# EAGLE design v3 bpard (EAGLE 6.4)
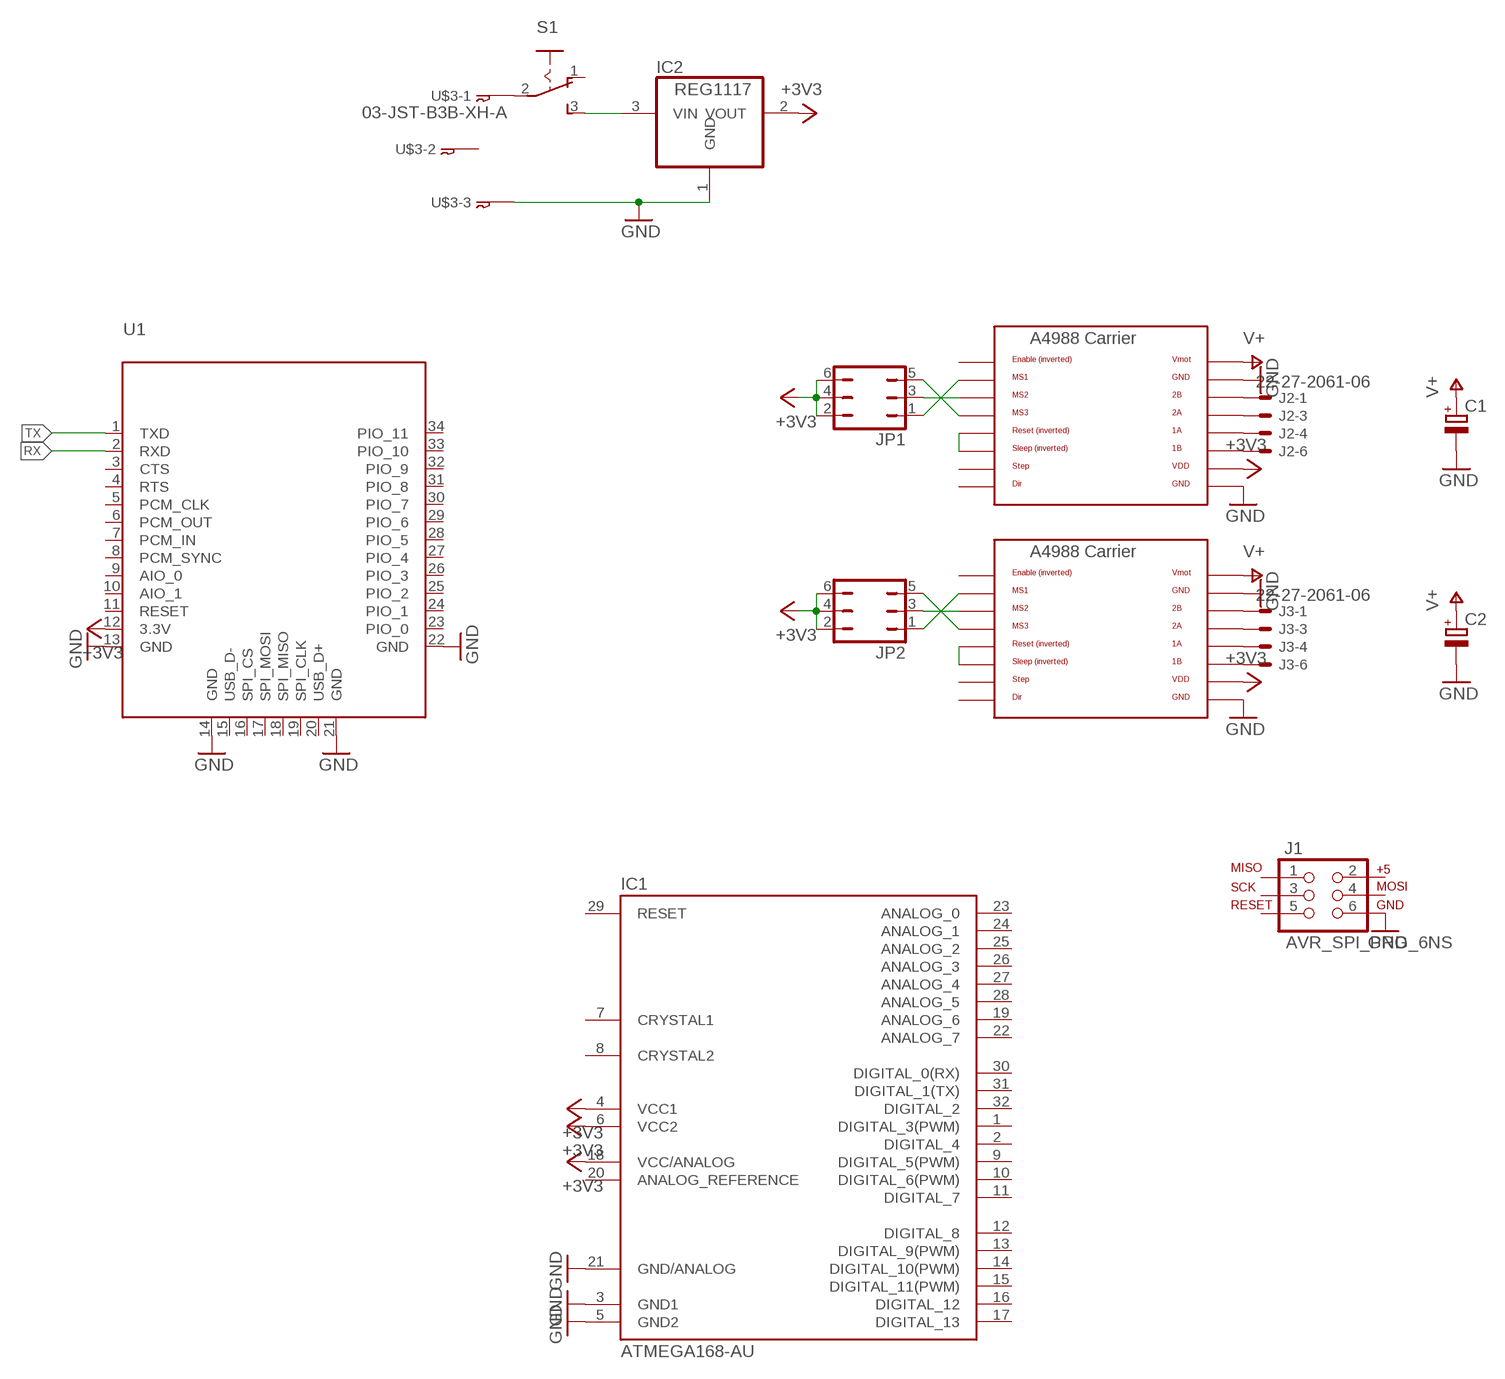
[diagram p0: schematic, sheet 1]

## Parts
C1  CPOL-EUE5-8.5  [E5-8,5]
C2  CPOL-EUE5-8.5  [E5-8,5]
IC1  ATMEGA168-AU  [TQFP32-08]
IC2  REG1117  [SOT223]
J1  AVR_SPI_PRG_6NS  [2X3-NS]
J2  22-27-2061-06  [6410-06]
J3  22-27-2061-06  [6410-06]
JP1  JP3Q  [JP3Q]
JP2  JP3Q  [JP3Q]
S1  255SB  [255SB]
U1  BLUETOOTH_MODULE  [BLUETOOTH_MODULE]
U$1  POLOLU_A4983CARRIER  [A4988BREAKOUT]
U$2  POLOLU_A4983CARRIER  [A4988BREAKOUT]
U$3  03-JST-B3B-XH-A  [B3B-XH]

## Nets
+3V3: IC1.4(VCC1) IC1.6(VCC2) IC1.18(VCC/ANALOG) IC2.2(VOUT) JP1.2 JP1.4 JP1.6 JP2.2 JP2.4 JP2.6 U1.12(3.3V) U$1.VDD U$2.VDD
GND: C1.- C2.- IC1.3(GND1) IC1.5(GND2) IC1.21(GND/ANALOG) IC2.1(GND) J1.6 U1.13(GND) U1.14(GND) U1.21(GND) U1.22(GND) U$1.GND U$1.GND@0(GND) U$2.GND U$2.GND@0(GND) U$3.P$3
N$1: J3.1 U$2.2B
N$2: J3.3 U$2.2A
N$3: J3.4 U$2.1A
N$4: J3.6 U$2.1B
N$5: J2.1 U$1.2B
N$6: J2.3 U$1.2A
N$7: J2.4 U$1.1A
N$8: J2.6 U$1.1B
N$9: JP2.5 U$2.MS3
N$10: JP1.3 U$1.MS2
N$11: JP2.1 U$2.MS1
N$12: JP1.1 U$1.MS1
N$13: JP2.3 U$2.MS2
N$14: JP1.5 U$1.MS3
N$15: S1.2(P) U$3.P$1
N$17: U$1.RST U$1.SLP(SLEEP)
N$18: U$2.RST U$2.SLP(SLEEP)
RX: U1.2(RXD)
TX: U1.1(TXD)
V+: C1.+ C2.+ IC2.3(VIN) S1.3(S) U$1.VMOT U$2.VMOT
Unconnected: IC1.1(DIGITAL_3(PWM)) IC1.2(DIGITAL_4) IC1.7(CRYSTAL1) IC1.8(CRYSTAL2) IC1.9(DIGITAL_5(PWM)) IC1.10(DIGITAL_6(PWM)) IC1.11(DIGITAL_7) IC1.12(DIGITAL_8) IC1.13(DIGITAL_9(PWM)) IC1.14(DIGITAL_10(PWM)) IC1.15(DIGITAL_11(PWM)) IC1.16(DIGITAL_12) IC1.17(DIGITAL_13) IC1.19(ANALOG_6) IC1.20(ANALOG_REFERENCE) IC1.22(ANALOG_7) IC1.23(ANALOG_0) IC1.24(ANALOG_1) IC1.25(ANALOG_2) IC1.26(ANALOG_3) IC1.27(ANALOG_4) IC1.28(ANALOG_5) IC1.29(RESET) IC1.30(DIGITAL_0(RX)) IC1.31(DIGITAL_1(TX)) IC1.32(DIGITAL_2) J1.1 J1.2 J1.3 J1.4 J1.5 J2.2 J2.5 J3.2 J3.5 S1.1(O) U1.3(CTS) U1.4(RTS) U1.5(PCM_CLK) U1.6(PCM_OUT) U1.7(PCM_IN) U1.8(PCM_SYNC) U1.9(AIO_0) U1.10(AIO_1) U1.11(RESET) U1.15(USB_D-) U1.16(SPI_CS) U1.17(SPI_MOSI) U1.18(SPI_MISO) U1.19(SPI_CLK) U1.20(USB_D+) U1.23(PIO_0) U1.24(PIO_1) U1.25(PIO_2) U1.26(PIO_3) U1.27(PIO_4) U1.28(PIO_5) U1.29(PIO_6) U1.30(PIO_7) U1.31(PIO_8) U1.32(PIO_9) U1.33(PIO_10) U1.34(PIO_11) U$1.DIR U$1.EN U$1.STEP U$2.DIR U$2.EN U$2.STEP U$3.P$2

## Library data of the parts
C1 C2 = rcl:CPOL-EU: POLARIZED CAPACITOR, European symbol
IC1 = Arduino-AVR:ATMEGA168
IC2 = burr-brown:REG1117: 800mA and 1A Low Dropout (LDO) Positive Regulator 1.8V, 2.5V, 2.85V, 3.3V, 5V, and Adj; MPN: REG1117; OC_FARNELL: 1097566; OC_NEWARK: 14P6981
J1 = AVR Header:AVR_SPI_PRG_6: AVR ISP 6 Pin This is the reduced ISP connector for AVR programming. Common on Arduino. This footprint will take up less PCB space and can be used with a 10-pin to 6-pin adapter such as SKU: BOB-08508
J2 J3 = con-molex:22-?-06: CONNECTOR wire to board 2.54 mm (.1 inch) pitch header; OC_FARNELL: unknown; OC_NEWARK: unknown
JP1 JP2 = jumper:JP3Q: JUMPER
S1 = switch:255SB: SLIDING SWITCH Distributor Buerklin, 11G810
U1 = microbuilder:BLUETOOTH_MODULE: BLUETOOTH MODULE
U$1 U$2 = RepRapjr:POLOLU_A4983CARRIER
U$3 = con-jst-xh:03-JST: JST CONNECTOR

## Board
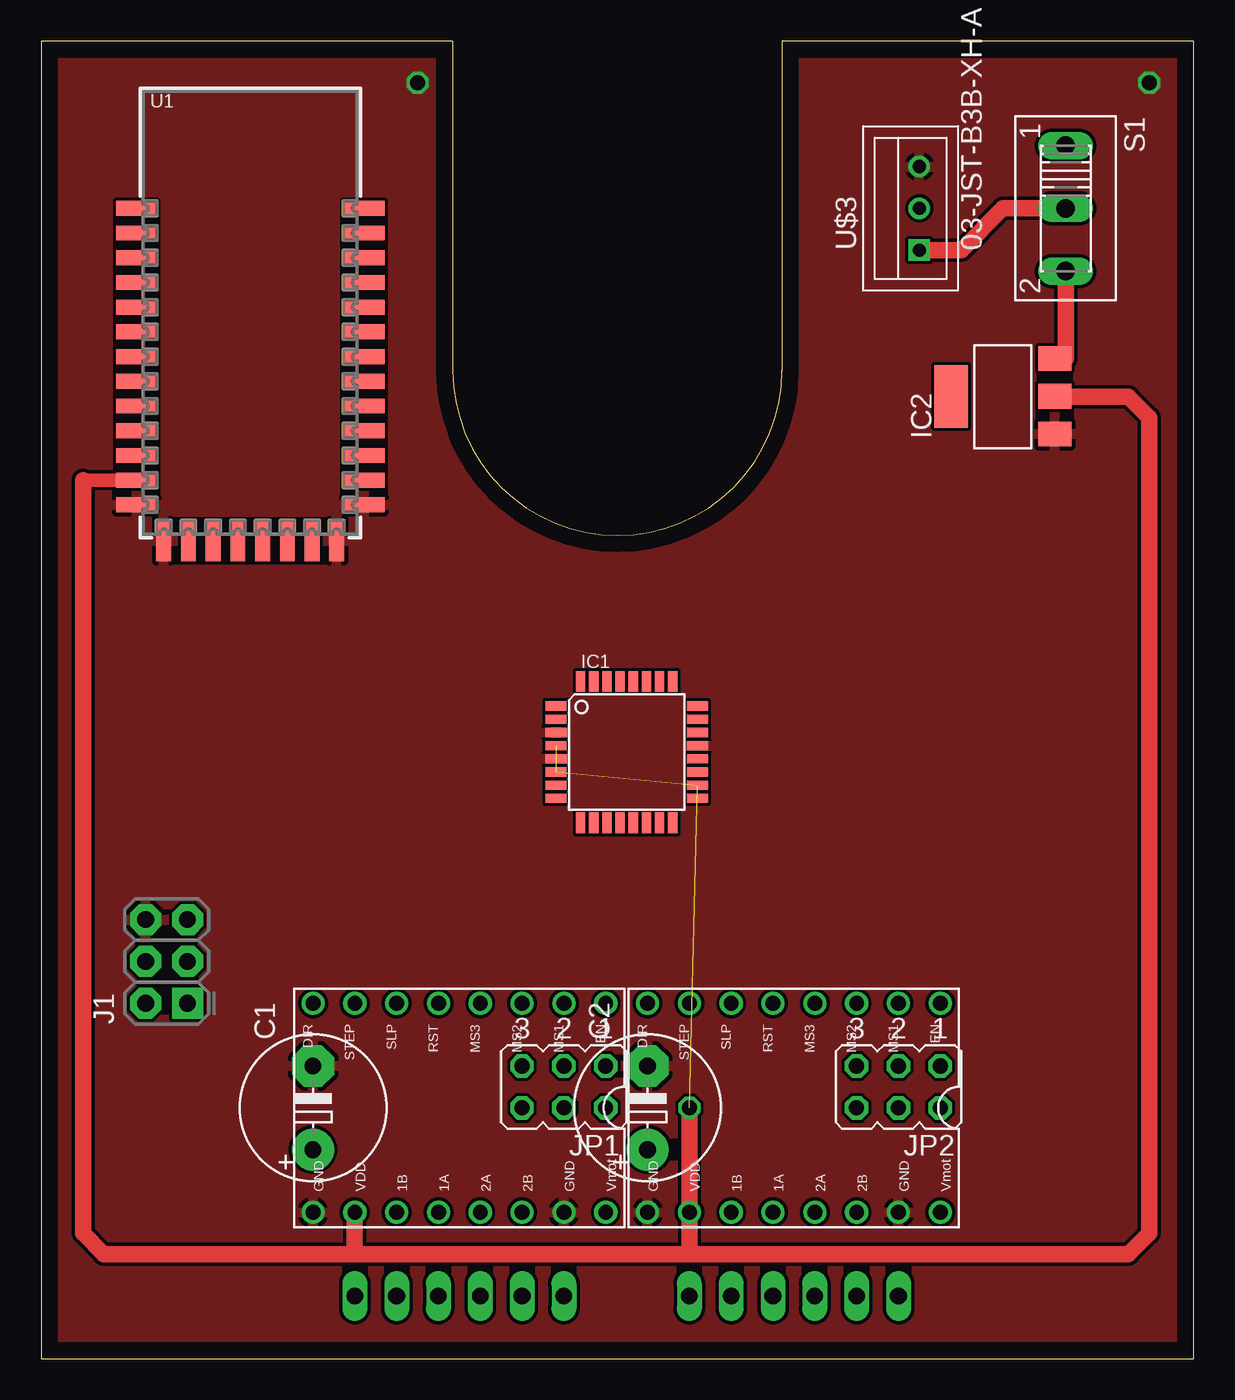
[diagram p1: board, top side]
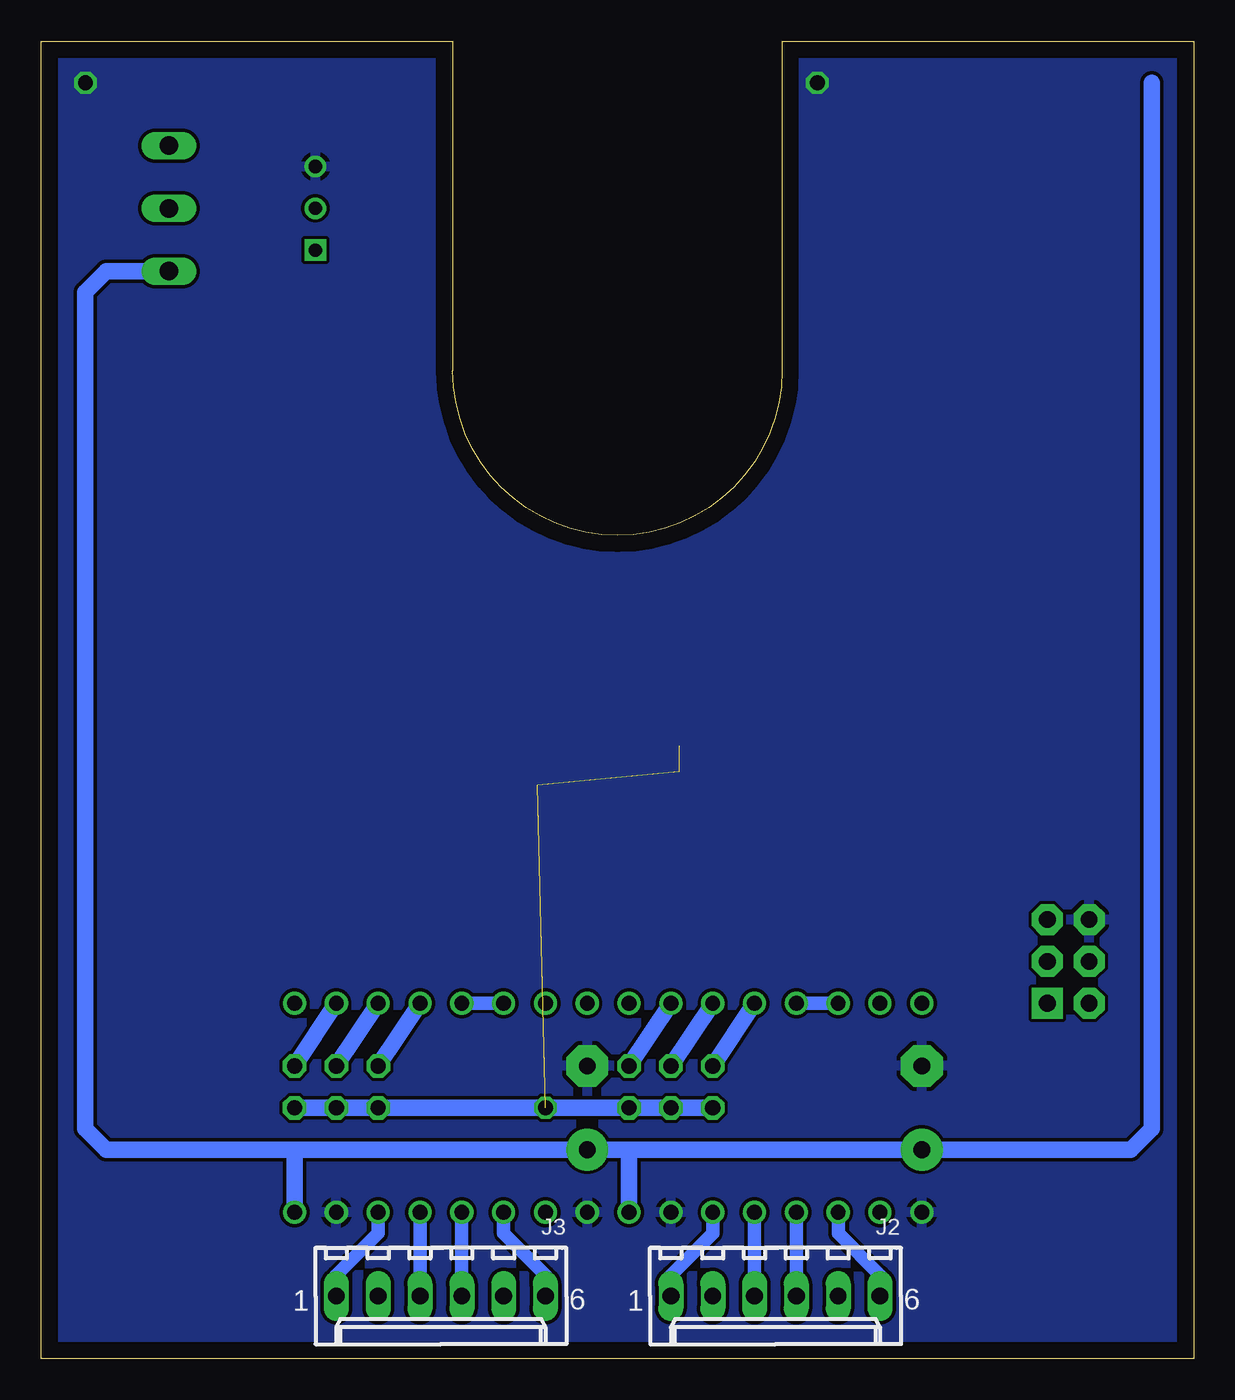
[diagram p2: board, bottom side, seen from below]

Size 70 x 80 mm. Coordinates in mm from the lower left corner, seen from the top.
Outline: 0,0 70,0 70,80 45,80 45,60 arc-180 25,60 25,80 0,80 0,0
Copper layers (1*16): Top 0.035mm / dielectric 1.5mm / Bottom 0.035mm
Design rules "default": minimum track width 10mil, minimum drill 0.6mm, track to track 8mil, track to pad 8mil, pad to pad 8mil, via to via 8mil, smd to smd 8mil, copper to edge 40mil, drill to drill 8mil, minimum pad ring 10mil, minimum via ring 8mil, stop-mask expansion 4mil, vias tented up to drill 0mil, thermal gap 10mil

### Footprints (pad centres in the part's own frame; a part is rotated, then mirrored left to right if it is on the bottom)
E5-8,5 = drill 1.016 pad 2.54: + -2.54,0 | drill 1.016 pad 2.54 octagon: - 2.54,0
TQFP32-08 = smd 1.27 x 0.559: 1 -4.293,2.8; 2 -4.293,2; 3 -4.293,1.2; 4 -4.293,0.4; 5 -4.293,-0.4; 6 -4.293,-1.2; 7 -4.293,-2; 8 -4.293,-2.8; 17 4.293,-2.8; 18 4.293,-2; 19 4.293,-1.2; 20 4.293,-0.4; 21 4.293,0.4; 22 4.293,1.2; 23 4.293,2; 24 4.293,2.8 | smd 0.559 x 1.27: 9 -2.8,-4.293; 10 -2,-4.293; 11 -1.2,-4.293; 12 -0.4,-4.293; 13 0.4,-4.293; 14 1.2,-4.293; 15 2,-4.293; 16 2.8,-4.293; 25 2.8,4.293; 26 2,4.293; 27 1.2,4.293; 28 0.4,4.293; 29 -0.4,4.293; 30 -1.2,4.293; 31 -2,4.293; 32 -2.8,4.293
SOT223 = smd 1.499 x 2.007: 1 -2.261,-3.15; 2 0.025,-3.15; 3 2.311,-3.15 | smd 3.81 x 2.007: 4 0,3.15
2X3-NS = drill 1.016 pad 1.88 square: 1 -2.54,-1.27 | drill 1.016 pad 1.88 octagon: 2 -2.54,1.27; 3 0,-1.27; 4 0,1.27; 5 2.54,-1.27; 6 2.54,1.27
6410-06 = drill 1.016 long: 1 6.35,0; 2 3.81,0; 3 1.27,0; 4 -1.27,0; 5 -3.81,0; 6 -6.35,0
JP3Q = drill 0.914 octagon: 1 -2.54,-1.27; 2 -2.54,1.27; 3 0,-1.27; 4 0,1.27; 5 2.54,-1.27; 6 2.54,1.27
255SB = drill 1.118 long: 1 -3.81,0; 2 0,0; 3 3.81,0
BLUETOOTH_MODULE = smd 2.5 x 0.9: 1 -6.9,6.35; 2 -6.9,4.85; 3 -6.9,3.35; 4 -6.9,1.85; 5 -6.9,0.35; 6 -6.9,-1.15; 7 -6.9,-2.65; 8 -6.9,-4.15; 9 -6.9,-5.65; 10 -6.9,-7.15; 11 -6.9,-8.65; 12 -6.9,-10.15; 13 -6.9,-11.65; 22 6.9,-11.65; 23 6.9,-10.15; 24 6.9,-8.65; 25 6.9,-7.15; 26 6.9,-5.65; 27 6.9,-4.15; 28 6.9,-2.65; 29 6.9,-1.15; 30 6.9,0.35; 31 6.9,1.85; 32 6.9,3.35; 33 6.9,4.85; 34 6.9,6.35 | smd 0.9 x 2.5: 14 -5.25,-13.83; 15 -3.75,-13.83; 16 -2.25,-13.83; 17 -0.75,-13.83; 18 0.75,-13.83; 19 2.25,-13.83; 20 3.75,-13.83; 21 5.25,-13.83
A4988BREAKOUT = drill 0.9: 1A 8.89,1.27; 1B 11.43,1.27; 2A 6.35,1.27; 2B 3.81,1.27; DIR 16.51,-11.43; EN -1.27,-11.43; GND 16.51,1.27; GND@0 1.27,1.27; MS1 1.27,-11.43; MS2 3.81,-11.43; MS3 6.35,-11.43; RST 8.89,-11.43; SLP 11.43,-11.43; STEP 13.97,-11.43; VDD 13.97,1.27; VMOT -1.27,1.27
B3B-XH = drill 0.8 square: P$1 -2.54,0 | drill 0.8: P$2 0,0; P$3 2.54,0

### Placement (x,y rotation side)
C1  16.51,15.24 90 top
C2  36.83,15.24 90 top
IC1  35.56,36.83 0 top
IC2  58.42,58.42 90 top
J1  7.62,24.13 90 top
J2  25.4,3.81 180 bottom
J3  45.72,3.81 180 bottom
JP1  31.75,16.51 180 top
JP2  52.07,16.51 180 top
S1  62.23,69.85 270 top
U1  12.7,63.5 0 top
U$1  33.02,10.16 180 top
U$2  53.34,10.16 180 top
U$3  53.34,69.85 90 top

### Tracks (layer width: path | path; a pad name or v marks a point on that pad's centre or on a via)
+3V3  (via drill 0.9)  (3 unrouted)
  Top 0.813: U1.12 2.55,53.35 2.54,53.34
  Top 1.016: IC2.2 61.57,58.42 66.04,58.42 67.31,57.15 67.31,7.62 66.04,6.35 39.37,6.35 | 39.37,6.35 U$2.VDD v39.37,15.24 | U$1.VDD 19.05,6.35 | 19.05,6.35 39.37,6.35 | 19.05,6.35 3.81,6.35 2.54,7.62 2.54,53.34
  Bottom 1.016: JP1.6 JP1.4 JP1.2 v39.37,15.24 JP2.6 JP2.4 JP2.2
GND  (via drill 0.9)
  other vias: 22.86,77.47 67.31,77.47
  pour Bottom: -3.81,81.28 72.39,81.28 72.39,-1.27 -3.81,-1.27
  pour Top: 71.12,81.28 0,81.28 0,-1.27 71.12,-1.27
N$1
  Bottom 0.813: J3.1 52.07,5.08 49.53,7.62 U$2.2B
N$2
  Bottom 0.813: J3.3 U$2.2A
N$3
  Bottom 0.813: J3.4 U$2.1A
N$4
  Bottom 0.813: J3.6 39.37,5.08 41.91,7.62 U$2.1B
N$5
  Bottom 0.813: U$1.2B 29.21,7.62 31.75,5.08 J2.1
N$6
  Bottom 0.813: J2.3 U$1.2A
N$7
  Bottom 0.813: U$1.1A J2.4
N$8
  Bottom 0.813: U$1.1B 21.59,7.62 19.05,5.08 J2.6
N$9
  Bottom 1.016: U$2.MS3 JP2.5
N$10
  Bottom 1.016: U$1.MS2 JP1.3
N$11
  Bottom 1.016: U$2.MS1 JP2.1
N$12
  Bottom 1.016: U$1.MS1 JP1.1
N$13
  Bottom 1.016: U$2.MS2 JP2.3
N$14
  Bottom 1.016: U$1.MS3 JP1.5
N$15
  Top 1.016: U$3.P$1 55.88,67.31 58.42,69.85 S1.2
N$17
  Bottom 0.813: U$1.SLP U$1.RST
N$18
  Bottom 0.813: U$2.SLP U$2.RST
V+
  Top 1.016: S1.3 62.23,60.73 IC2.3
  Bottom 1.016: S1.3 66.04,66.04 67.31,64.77 67.31,13.97 66.04,12.7 54.61,12.7 | 34.29,12.7 C1.+ 3.81,12.7 2.54,13.97 2.54,77.47 | 34.29,12.7 C2.+ 54.61,12.7 | U$1.VMOT 34.29,12.7 | U$2.VMOT 54.61,12.7